# EAGLE design 2021-01-21_HALO_ToF_Board-Autorouted (EAGLE 9.6.2)
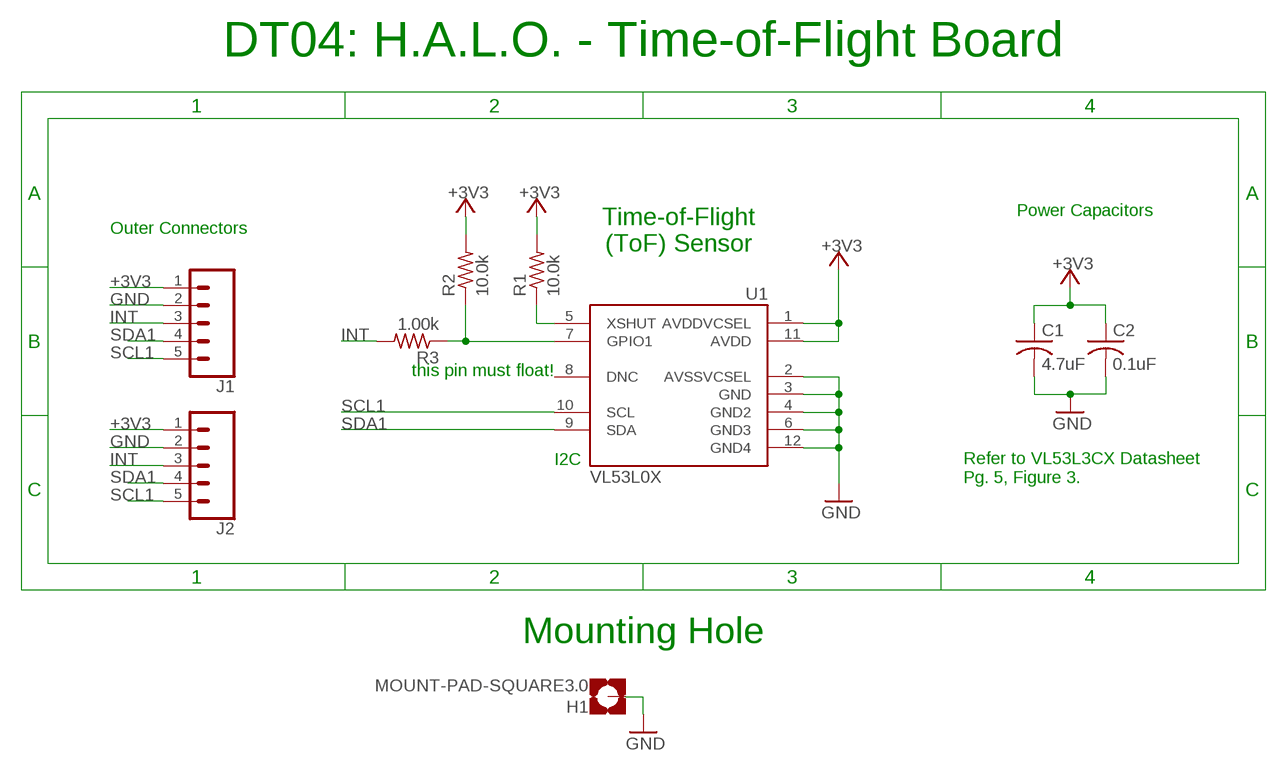
[diagram p0: schematic, sheet 1]

## Parts
C1  4.7uF  C-USC0805  [C0805]
C2  0.1uF  C-USC0805  [C0805]
H1  MOUNT-PAD-SQUARE3.0  [3,0-PAD-SQUARE]
J1  CONN_05  [1X05]
J2  CONN_05  [1X05]
R1  10.0k  R-US_R0805  [R0805]
R2  10.0k  R-US_R0805  [R0805]
R3  1.00k  R-US_R0805  [R0805]
U1  VL53L0X  AS-ITM-00338  [VL53L0X]

## Nets
+3V3: C1.1 C2.1 J1.1 J2.1 R1.2 R2.2 U1.1(AVDDVCSEL) U1.11(AVDD)
GND: C1.2 C2.2 H1.B3,0(MOUNT) J1.2 J2.2 U1.2(AVSSVCSEL) U1.3(GND) U1.4(GND2) U1.6(GND3) U1.12(GND4)
INT: J1.3 J2.3 R3.2
N$1: R1.1 U1.5(XSHUT)
N$2: R2.1 R3.1 U1.7(GPIO1)
SCL1: J1.5 J2.5 U1.10(SCL)
SDA1: J1.4 J2.4 U1.9(SDA)
Unconnected: U1.8(DNC)

## Notes on the sheet
- DT04: H.A.L.O. - Time-of-Flight Board
- Power Capacitors
- Outer Connectors
- Time-of-Flight
  (ToF) Sensor
- this pin must float!
- I2C
- Refer to VL53L3CX Datasheet
  Pg. 5, Figure 3.
- Mounting Hole

## Library data of the parts
C1 C2 = rcl:C-US: CAPACITOR, American symbol
H1 = holes:MOUNT-PAD-SQUARE: MOUNTING PAD, square
J1 J2 = SparkFun-Connectors:CONN_05: Multi connection point. Often used as Generic Header-pin footprint for 0.1 inch spaced/style header connections On any of the 0.1 inch spaced packages, you can populate with these: Break Away Headers - Straight <https://www.sparkfun.com/products/116> (PRT-00116) Break Away Male Headers - Right Angle <https://www.sparkfun.com/products/553> (PRT-00553) Female Headers <https://www.sparkfun.com/products/115> (PRT-00115) Break Away Headers - Machine Pin <https://www.sparkfun.com/products/117> (PRT-00117) Break Away Female Headers - Swiss Machine Pin <https://www.sparkfun.com/products/743> (PRT-00743) For SCREWTERMINALS and SPRING TERMINALS visit here: Screw Terimnals on SparkFun.com <https://www.sparkfun.com/search/results?term=Screw+Terminals> (5mm/3.5mm/2.54mm spacing) This device is also useful as a general connection point to wire up your design to another part of your project. Our various solder wires solder well into these plated through hole pads. Hook-Up Wire - Assortment (Stranded, 22 AWG) <https://www.sparkfun.com/products/11375> (PRT-11375) Hook-Up Wire - Assortment (Solid Core, 22 AWG) <https://www.sparkfun.com/products/11367> (PRT-11367) View the entire wire category on our website here <https://www.sparkfun.com/categories/141> Special notes: Molex polarized connector foot print use with SKU : PRT-08231 with associated crimp pins and housings. 1MM SMD Version SKU: PRT-10208
R1-R3 = rcl:R-US_: RESISTOR, American symbol
U1 = tinycircuits:AS-ITM-00338: SENSOR LASER DISTANCE TOF 2M; PARTNO: AS-ITM-00338

## Board
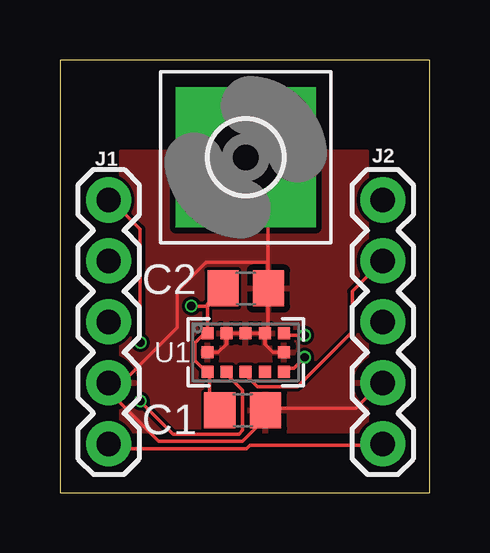
[diagram p1: board, top side]
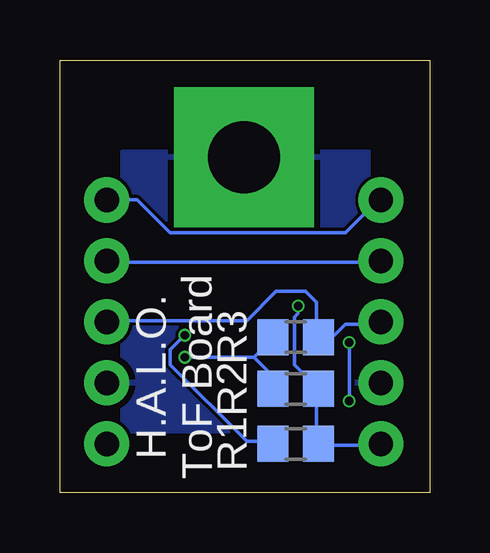
[diagram p2: board, bottom side, seen from below]

Size 15.42 x 18.02 mm. Coordinates in mm from the lower left corner, seen from the top.
Outline: 0,0 15.42,0 15.42,18.02 0,18.02 0,0
Copper layers (1*16): Top 0.035559375mm / dielectric 1.6mm / Bottom 0.035559375mm
Design rules "jlcpcb2layer": minimum track width 5mil, minimum drill 12mil, track to track 5mil, track to pad 5mil, pad to pad 5mil, via to via 5mil, smd to smd 5mil, copper to edge 8mil, drill to drill 6mil, minimum pad ring 5mil, minimum via ring 3mil, stop-mask expansion 2.5mil, vias tented up to drill 0mil, thermal gap 10mil

### Footprints (pad centres in the part's own frame; a part is rotated, then mirrored left to right if it is on the bottom)
C0805 = smd 1.3 x 1.5: 1 -0.95,0; 2 0.95,0
3,0-PAD-SQUARE = drill 3 pad 5.842 square: B3,0 0,0
1X05 = drill 1.016 pad 1.88: 1 0,0; 2 2.54,0; 3 5.08,0; 4 7.62,0; 5 10.16,0
R0805 = smd 1.3 x 1.5: 1 -0.95,0; 2 0.95,0
VL53L0X = smd 0.5 x 0.5: 1 1.6,-0.8; 2 0.8,-0.8; 3 0,-0.8; 4 -0.8,-0.8; 5 -1.6,-0.8; 6 -1.6,0; 7 -1.6,0.8; 8 -0.8,0.8; 9 0,0.8; 10 0.8,0.8; 11 1.6,0.8; 12 1.6,0

### Placement (x,y rotation side)
C1  7.62,3.43 0 top
C2  7.75,8.51 0 top
H1  7.75,13.97 0 top
J1  2.03,2.03 90 top
J2  13.46,2.03 90 top
R1  5.59,2.03 0 bottom
R2  5.59,4.32 0 bottom
R3  5.59,6.48 0 bottom
U1  7.75,5.84 180 top

### Tracks (layer width: path | path; a pad name or v marks a point on that pad's centre or on a via)
+3V3  (via drill 0.35)
  Top 0.152: 6.15,7.77 U1.1 6.1,6.71 5.64,6.25 5.64,5.49 5.94,5.18 6.1,5.18 U1.11 6.25,5.03 6.25,3.81 6.55,3.5 C1.1 | 6.15,7.77 6.15,7.86 C2.1 | v5.49,7.77 6.15,7.77 | J2.1 13.41,1.98 7.92,1.98 7.77,1.83 2.29,1.83 2.13,1.98 J1.1
  Bottom 0.152: v5.49,7.77 5.49,7.47 5.64,7.32 5.64,5.33 4.72,4.42 R2.2 4.72,4.27 4.72,2.13 R1.2 4.57,1.98 2.13,1.98 J1.1
GND
  Top 0.152: U1.4 U1.3 U1.2 6.95,6.18 6.6,5.84 U1.12 | U1.4 8.55,6.18 8.89,5.84 U1.6 | J2.2 13.41,4.57 12.34,3.5 8.69,3.5 C1.2 8.53,3.35 8.53,3.05 7.62,2.13 4.12,2.13 2.13,4.12 2.13,4.57 | U1.4 8.69,6.71 8.69,8.38 C2.2 8.69,8.53 8.69,9.6 | 8.69,9.6 8.69,12.95 7.77,13.87 H1.B3,0 | 2.13,4.57 2.59,4.57 4.88,6.86 4.88,8.38 6.1,9.6 8.69,9.6 | 2.13,4.57 J1.2
  pour Top: 2.54,2.54 2.54,14.22 12.83,14.22 12.83,2.54
  pour Bottom: 2.54,2.54 2.54,14.22 12.83,14.22 12.83,2.54
INT
  Bottom 0.152: J1.3 2.13,7.01 3.5,7.01 3.96,6.55 4.57,6.55 R3.2 4.72,6.55 4.72,7.92 5.18,8.38 6.4,8.38 7.62,7.16 13.41,7.16 J2.3
N$1  (via drill 0.35)
  Top 0.152: v10.21,6.55 9.45,6.55 U1.5
  Bottom 0.152: v10.21,6.55 10.82,5.94 10.82,5.33 7.62,2.13 6.55,2.13 R1.1
N$2  (via drill 0.35)
  Top 0.152: v10.21,5.64 9.75,5.18 9.45,5.18 U1.7
  Bottom 0.152: 7.32,5.64 v10.21,5.64 | 7.32,5.64 6.55,6.4 R3.1 | 7.32,5.64 6.55,4.88 6.55,4.42 R2.1
SCL1  (via drill 0.35)
  Top 0.152: v3.35,3.81 4.72,2.44 7.47,2.44 7.62,2.59 7.62,4.27 7.01,4.88 7.01,5.03 U1.10 | v3.35,6.25 3.35,10.97 2.13,12.19 J1.5
  Bottom 0.152: v3.35,6.25 v3.35,3.81 | J2.5 12.19,12.19 10.82,10.82 3.5,10.82 2.13,12.19 J1.5
SDA1
  Top 0.152: J2.4 12.19,8.38 12.19,6.71 9.91,4.42 8.23,4.42 7.77,4.88 7.77,5.03 U1.9
  Bottom 0.152: J1.4 2.13,9.6 13.41,9.6 J2.4

### Text on the board
bNames: H.A.L.O. / ToF Board